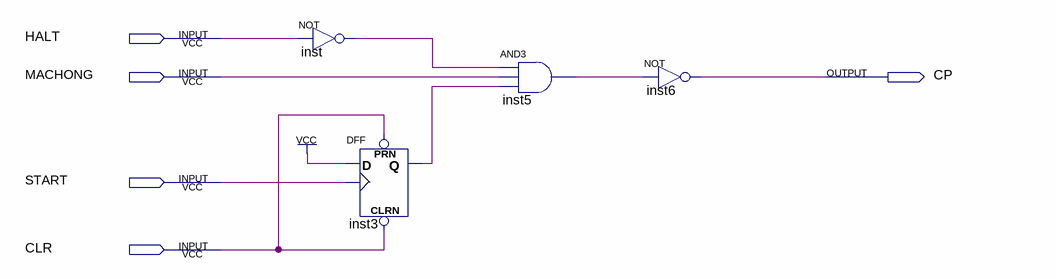
[diagram p0: schematic sheet]
// Quartus schematic halt.bdf as structural Verilog: 4 symbols, 5 pins
module halt (
  input  HALT,
  input  MACHONG,
  input  START,
  input  CLR,
  output CP
);

  wire inst3_q, inst5_out, inst_out;

  not inst (inst_out, HALT);
  DFF inst3 (.CLRN(CLR), .CLK(START), .D(1'b1), .PRN(CLR), .Q(inst3_q));
  and inst5 (inst5_out, inst_out, MACHONG, inst3_q);
  not inst6 (CP, inst5_out);
endmodule
